# EAGLE schematic ledCubeV2.0 (EAGLE 9.6.2)
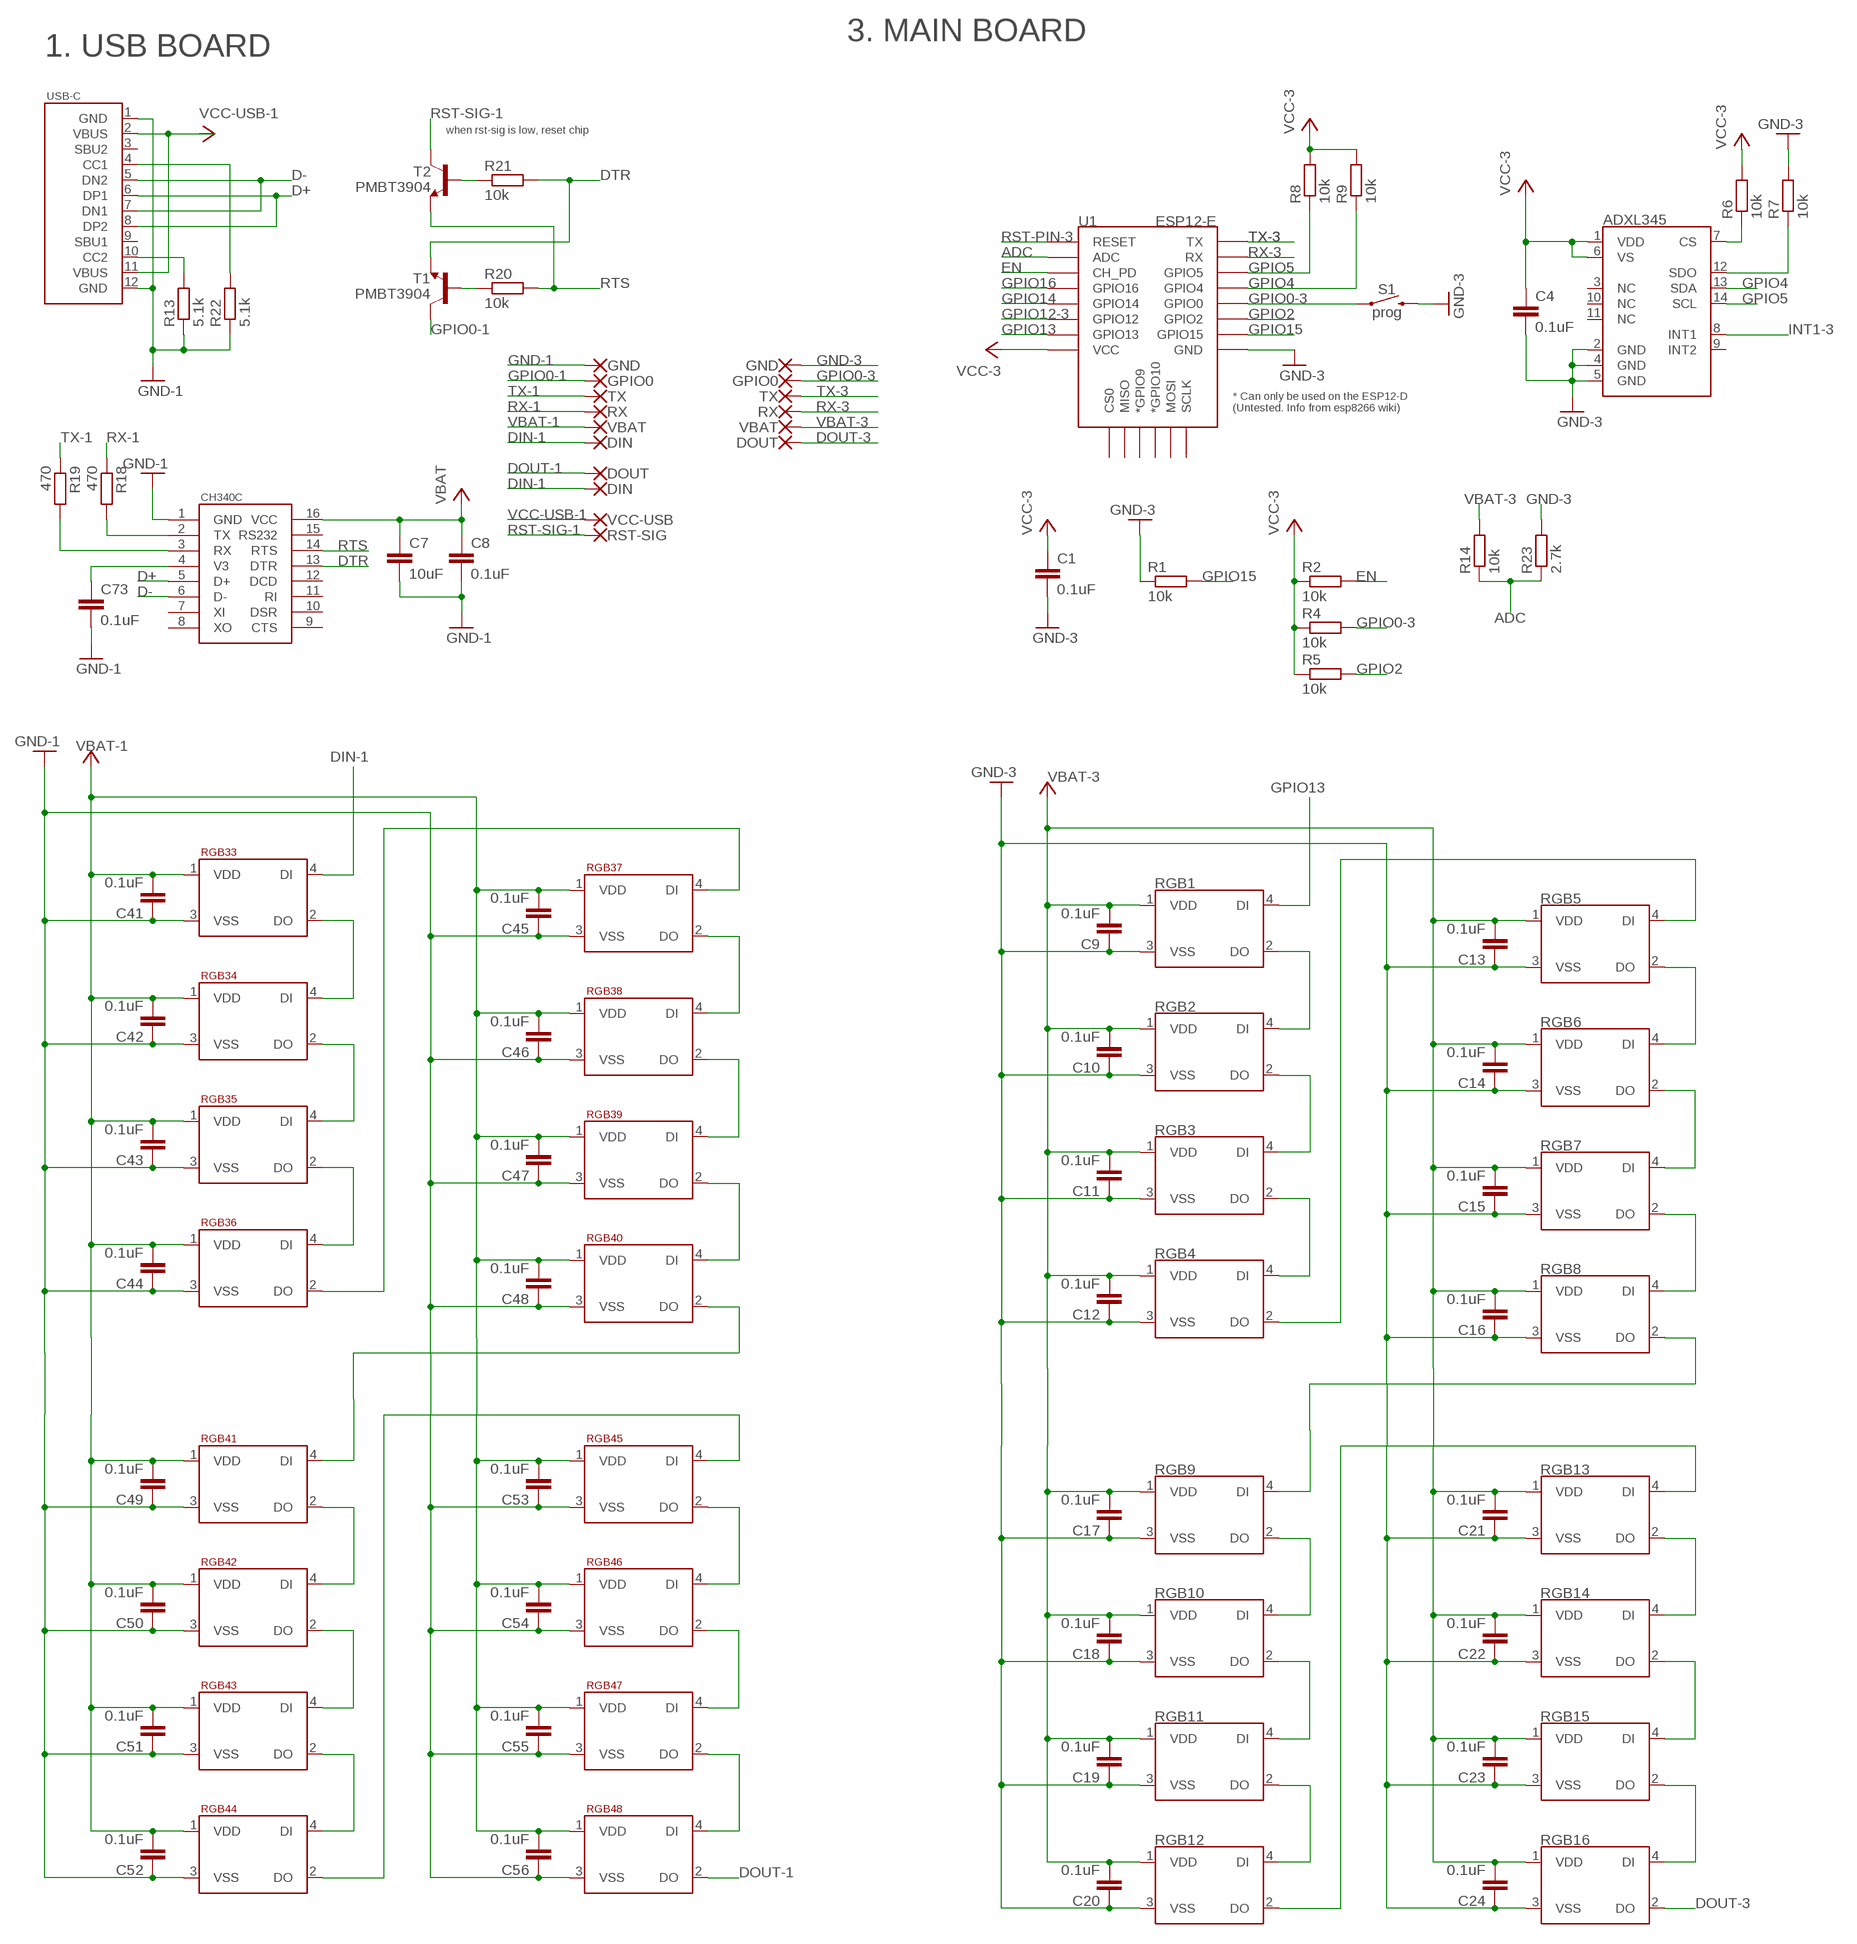
[diagram p0: schematic, sheet 1, part 1 of 2]
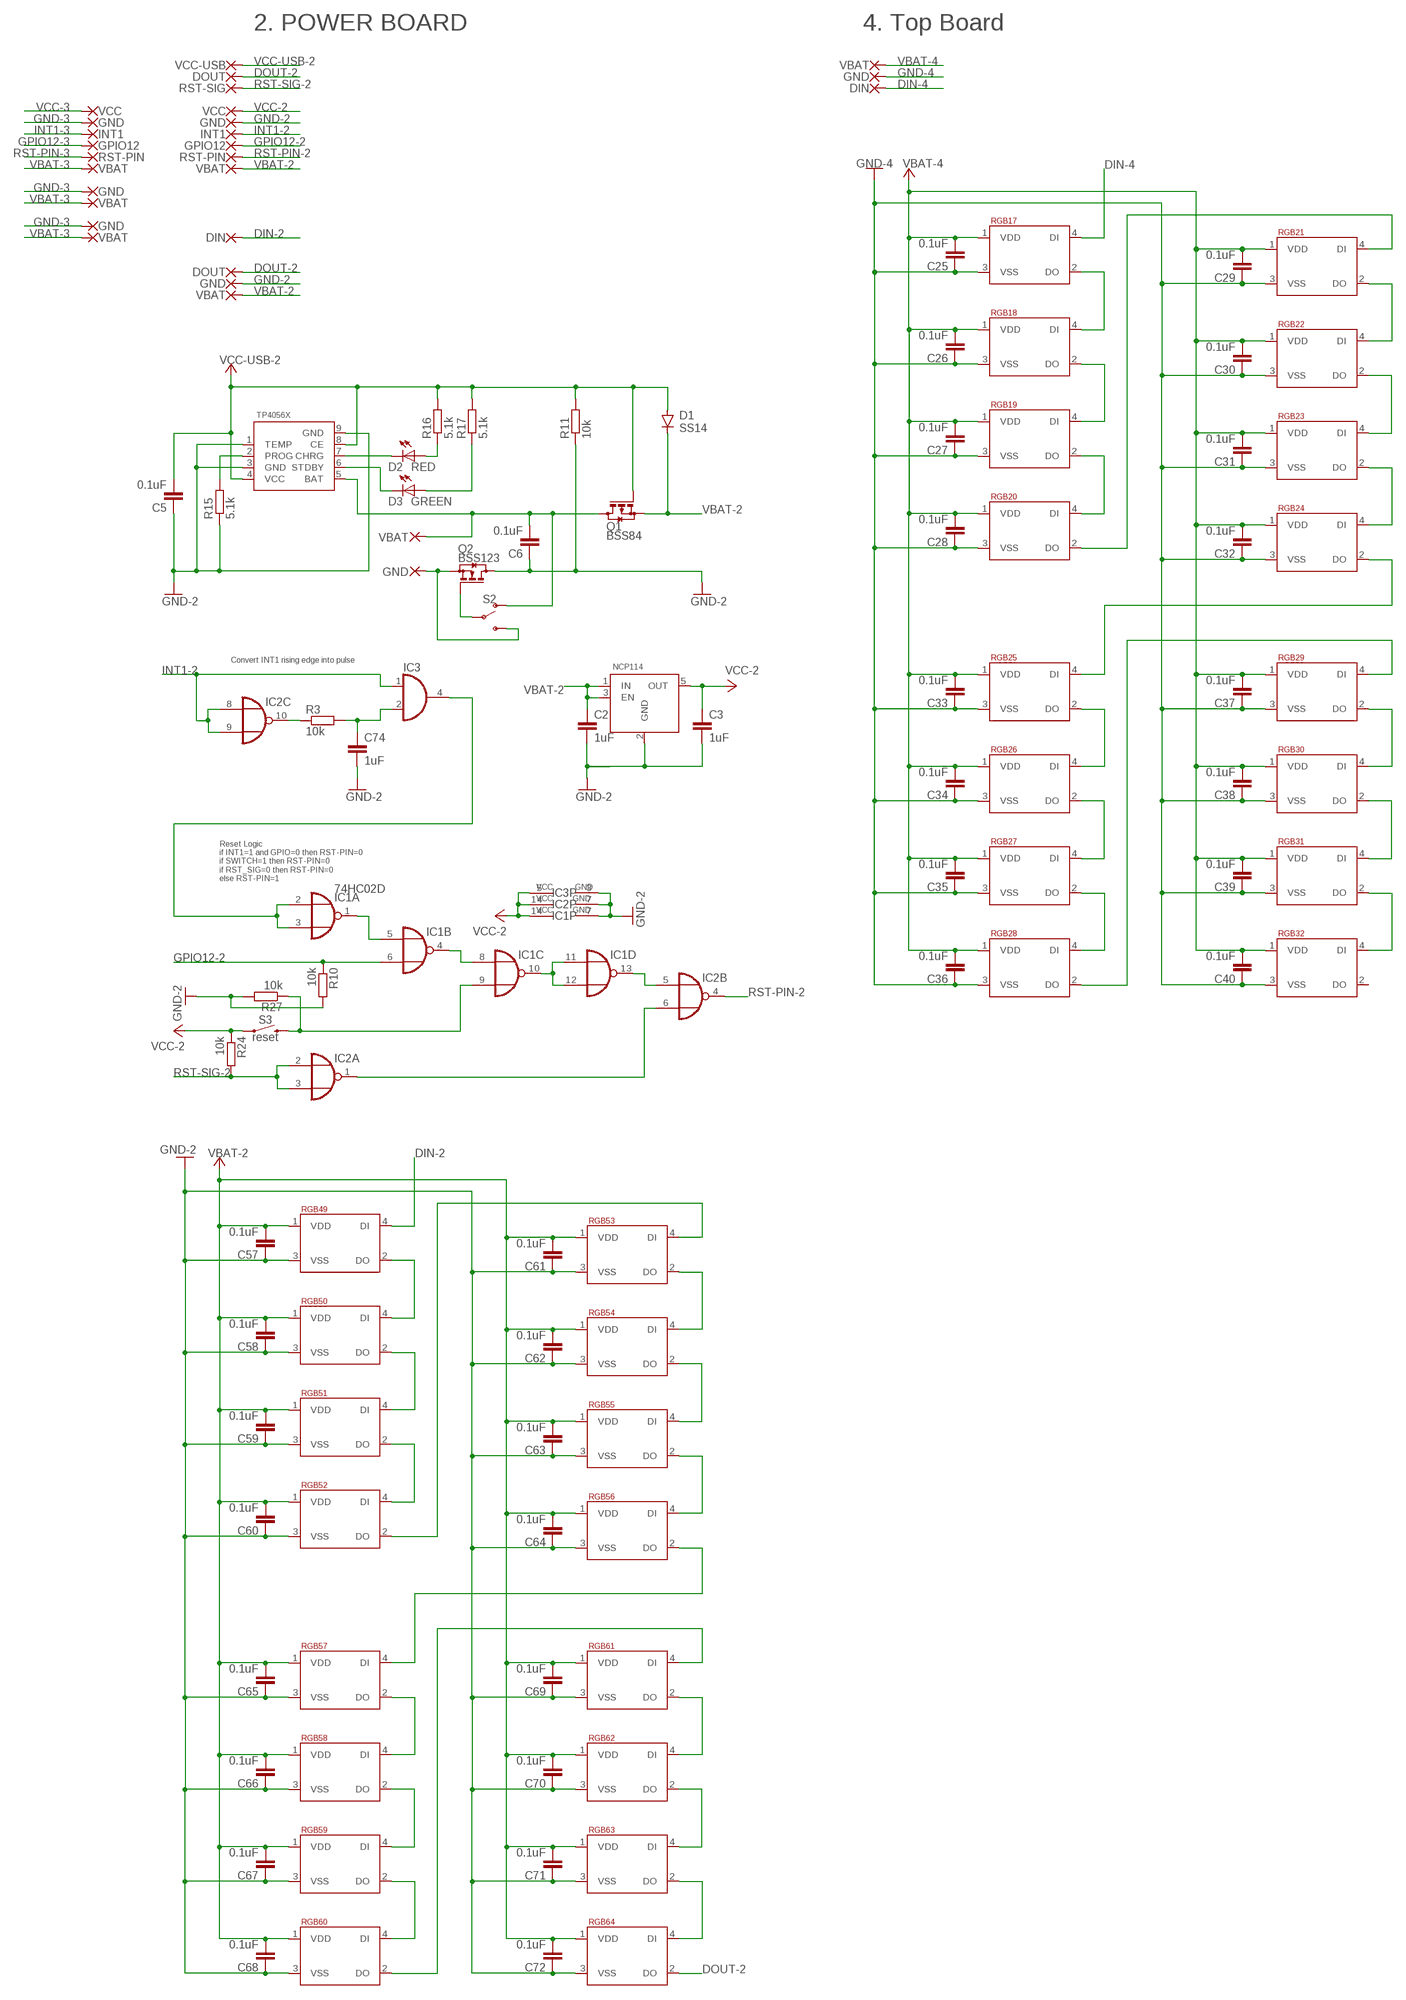
[diagram p1: schematic, sheet 1, part 2 of 2]

## Parts
ADXL345  ADXL345  [LGA-14]
C1  0.1uF  CC0603  [C0603]
C2  1uF  CC0603  [C0603]
C3  1uF  CC0603  [C0603]
C4  0.1uF  CC0603  [C0603]
C5  0.1uF  CC0603  [C0603]
C6  0.1uF  CC0603  [C0603]
C7  10uF  CC0603  [C0603]
C8  0.1uF  CC0603  [C0603]
C9  0.1uF  CC0603  [C0603]
C10  0.1uF  CC0603  [C0603]
C11  0.1uF  CC0603  [C0603]
C12  0.1uF  CC0603  [C0603]
C13  0.1uF  CC0603  [C0603]
C14  0.1uF  CC0603  [C0603]
C15  0.1uF  CC0603  [C0603]
C16  0.1uF  CC0603  [C0603]
C17  0.1uF  CC0603  [C0603]
C18  0.1uF  CC0603  [C0603]
C19  0.1uF  CC0603  [C0603]
C20  0.1uF  CC0603  [C0603]
C21  0.1uF  CC0603  [C0603]
C22  0.1uF  CC0603  [C0603]
C23  0.1uF  CC0603  [C0603]
C24  0.1uF  CC0603  [C0603]
C25  0.1uF  CC0603  [C0603]
C26  0.1uF  CC0603  [C0603]
C27  0.1uF  CC0603  [C0603]
C28  0.1uF  CC0603  [C0603]
C29  0.1uF  CC0603  [C0603]
C30  0.1uF  CC0603  [C0603]
C31  0.1uF  CC0603  [C0603]
C32  0.1uF  CC0603  [C0603]
C33  0.1uF  CC0603  [C0603]
C34  0.1uF  CC0603  [C0603]
C35  0.1uF  CC0603  [C0603]
C36  0.1uF  CC0603  [C0603]
C37  0.1uF  CC0603  [C0603]
C38  0.1uF  CC0603  [C0603]
C39  0.1uF  CC0603  [C0603]
C40  0.1uF  CC0603  [C0603]
C41  0.1uF  CC0603  [C0603]
C42  0.1uF  CC0603  [C0603]
C43  0.1uF  CC0603  [C0603]
C44  0.1uF  CC0603  [C0603]
C45  0.1uF  CC0603  [C0603]
C46  0.1uF  CC0603  [C0603]
C47  0.1uF  CC0603  [C0603]
C48  0.1uF  CC0603  [C0603]
C49  0.1uF  CC0603  [C0603]
C50  0.1uF  CC0603  [C0603]
C51  0.1uF  CC0603  [C0603]
C52  0.1uF  CC0603  [C0603]
C53  0.1uF  CC0603  [C0603]
C54  0.1uF  CC0603  [C0603]
C55  0.1uF  CC0603  [C0603]
C56  0.1uF  CC0603  [C0603]
C57  0.1uF  CC0603  [C0603]
C58  0.1uF  CC0603  [C0603]
C59  0.1uF  CC0603  [C0603]
C60  0.1uF  CC0603  [C0603]
C61  0.1uF  CC0603  [C0603]
C62  0.1uF  CC0603  [C0603]
C63  0.1uF  CC0603  [C0603]
C64  0.1uF  CC0603  [C0603]
C65  0.1uF  CC0603  [C0603]
C66  0.1uF  CC0603  [C0603]
C67  0.1uF  CC0603  [C0603]
C68  0.1uF  CC0603  [C0603]
C69  0.1uF  CC0603  [C0603]
C70  0.1uF  CC0603  [C0603]
C71  0.1uF  CC0603  [C0603]
C72  0.1uF  CC0603  [C0603]
C73  0.1uF  CC0603  [C0603]
C74  1uF  CC0603  [C0603]
CH340C  CH340G  [SOIC16]
D1  SS14  DIODE-DO-214AC  [DO-214AC]
D2  RED  LED_ESML0603  [LED_SML0603]
D3  GREEN  LED_ESML0603  [LED_SML0603]
GND  SMD2  [SMD1,27-2,54]
GND-1  GND  SMD2  [SMD1,27-2,54]
GND-2  RX  SMD2  [SMD1,27-2,54]
GPIO0-1  GPIO0  SMD2  [SMD1,27-2,54]
GPIO0-2  GPIO0  SMD2  [SMD1,27-2,54]
IC1  74HC02D  [SO14]
IC2  74HC02D  [SO14]
IC3  74AHC1G08DCK  [SC70-5]
NCP114  NCP114  [TSOP-5]
Q1  BSS84  [SOT23]
Q2  BSS123  [SOT23]
R1  10k  RR0603  [R0603]
R2  10k  RR0603  [R0603]
R3  10k  RR0603  [R0603]
R4  10k  RR0603  [R0603]
R5  10k  RR0603  [R0603]
R6  10k  RR0603  [R0603]
R7  10k  RR0603  [R0603]
R8  10k  RR0603  [R0603]
R9  10k  RR0603  [R0603]
R10  10k  RR0603  [R0603]
R11  10k  RR0603  [R0603]
R13  5.1k  RR0603  [R0603]
R14  10k  RR0603  [R0603]
R15  5.1k  RR0603  [R0603]
R16  5.1k  RR0603  [R0603]
R17  5.1k  RR0603  [R0603]
R18  470  RR0603  [R0603]
R19  470  RR0603  [R0603]
R20  10k  RR0603  [R0603]
R21  10k  RR0603  [R0603]
R22  5.1k  RR0603  [R0603]
R23  2.7k  RR0603  [R0603]
R24  10k  RR0603  [R0603]
R27  10k  RR0603  [R0603]
RGB1  WS2812B  WS2812B-MINI  [WS2812B-MINI]
RGB2  WS2812B  WS2812B-MINI  [WS2812B-MINI]
RGB3  WS2812B  WS2812B-MINI  [WS2812B-MINI]
RGB4  WS2812B  WS2812B-MINI  [WS2812B-MINI]
RGB5  WS2812B  WS2812B-MINI  [WS2812B-MINI]
RGB6  WS2812B  WS2812B-MINI  [WS2812B-MINI]
RGB7  WS2812B  WS2812B-MINI  [WS2812B-MINI]
RGB8  WS2812B  WS2812B-MINI  [WS2812B-MINI]
RGB9  WS2812B  WS2812B-MINI  [WS2812B-MINI]
RGB10  WS2812B  WS2812B-MINI  [WS2812B-MINI]
RGB11  WS2812B  WS2812B-MINI  [WS2812B-MINI]
RGB12  WS2812B  WS2812B-MINI  [WS2812B-MINI]
RGB13  WS2812B  WS2812B-MINI  [WS2812B-MINI]
RGB14  WS2812B  WS2812B-MINI  [WS2812B-MINI]
RGB15  WS2812B  WS2812B-MINI  [WS2812B-MINI]
RGB16  WS2812B  WS2812B-MINI  [WS2812B-MINI]
RGB17  WS2812B  WS2812B-MINI  [WS2812B-MINI]
RGB18  WS2812B  WS2812B-MINI  [WS2812B-MINI]
RGB19  WS2812B  WS2812B-MINI  [WS2812B-MINI]
RGB20  WS2812B  WS2812B-MINI  [WS2812B-MINI]
RGB21  WS2812B  WS2812B-MINI  [WS2812B-MINI]
RGB22  WS2812B  WS2812B-MINI  [WS2812B-MINI]
RGB23  WS2812B  WS2812B-MINI  [WS2812B-MINI]
RGB24  WS2812B  WS2812B-MINI  [WS2812B-MINI]
RGB25  WS2812B  WS2812B-MINI  [WS2812B-MINI]
RGB26  WS2812B  WS2812B-MINI  [WS2812B-MINI]
RGB27  WS2812B  WS2812B-MINI  [WS2812B-MINI]
RGB28  WS2812B  WS2812B-MINI  [WS2812B-MINI]
RGB29  WS2812B  WS2812B-MINI  [WS2812B-MINI]
RGB30  WS2812B  WS2812B-MINI  [WS2812B-MINI]
RGB31  WS2812B  WS2812B-MINI  [WS2812B-MINI]
RGB32  WS2812B  WS2812B-MINI  [WS2812B-MINI]
RGB33  WS2812B  WS2812B-MINI  [WS2812B-MINI]
RGB34  WS2812B  WS2812B-MINI  [WS2812B-MINI]
RGB35  WS2812B  WS2812B-MINI  [WS2812B-MINI]
RGB36  WS2812B  WS2812B-MINI  [WS2812B-MINI]
RGB37  WS2812B  WS2812B-MINI  [WS2812B-MINI]
RGB38  WS2812B  WS2812B-MINI  [WS2812B-MINI]
RGB39  WS2812B  WS2812B-MINI  [WS2812B-MINI]
RGB40  WS2812B  WS2812B-MINI  [WS2812B-MINI]
RGB41  WS2812B  WS2812B-MINI  [WS2812B-MINI]
RGB42  WS2812B  WS2812B-MINI  [WS2812B-MINI]
RGB43  WS2812B  WS2812B-MINI  [WS2812B-MINI]
RGB44  WS2812B  WS2812B-MINI  [WS2812B-MINI]
RGB45  WS2812B  WS2812B-MINI  [WS2812B-MINI]
RGB46  WS2812B  WS2812B-MINI  [WS2812B-MINI]
RGB47  WS2812B  WS2812B-MINI  [WS2812B-MINI]
RGB48  WS2812B  WS2812B-MINI  [WS2812B-MINI]
RGB49  WS2812B  WS2812B-MINI  [WS2812B-MINI]
RGB50  WS2812B  WS2812B-MINI  [WS2812B-MINI]
RGB51  WS2812B  WS2812B-MINI  [WS2812B-MINI]
RGB52  WS2812B  WS2812B-MINI  [WS2812B-MINI]
RGB53  WS2812B  WS2812B-MINI  [WS2812B-MINI]
RGB54  WS2812B  WS2812B-MINI  [WS2812B-MINI]
RGB55  WS2812B  WS2812B-MINI  [WS2812B-MINI]
RGB56  WS2812B  WS2812B-MINI  [WS2812B-MINI]
RGB57  WS2812B  WS2812B-MINI  [WS2812B-MINI]
RGB58  WS2812B  WS2812B-MINI  [WS2812B-MINI]
RGB59  WS2812B  WS2812B-MINI  [WS2812B-MINI]
RGB60  WS2812B  WS2812B-MINI  [WS2812B-MINI]
RGB61  WS2812B  WS2812B-MINI  [WS2812B-MINI]
RGB62  WS2812B  WS2812B-MINI  [WS2812B-MINI]
RGB63  WS2812B  WS2812B-MINI  [WS2812B-MINI]
RGB64  WS2812B  WS2812B-MINI  [WS2812B-MINI]
RST-SIG-1  RST-SIG  SMD2  [SMD1,27-2,54]
RST-SIG-2  TX  SMD2  [SMD1,27-2,54]
RX-1  RX  SMD2  [SMD1,27-2,54]
RX-2  GND  SMD2  [SMD1,27-2,54]
RX-3  GND  SMD2  [SMD1,27-2,54]
S1  prog  MOMENTARY-SWITCH-SPST-SMD-6.0X3.5MM  [TACTILE_SWITCH_SMD_6.0X3.5MM]
S2  ON/CHRG  SWITCH-SPDT-SMD-RIGHT-ANGLE  [SWITCH_SPST_SMD_A]
S3  reset  MOMENTARY-SWITCH-SPST-SMD-6.0X3.5MM  [TACTILE_SWITCH_SMD_6.0X3.5MM]
T1  PMBT3904  MMBT3904LT1-NPN-SOT23-BEC  [SOT23-BEC]
T2  PMBT3904  MMBT3904LT1-NPN-SOT23-BEC  [SOT23-BEC]
TP4056X  TP4056X  [ESPO8]
TX-1  TX  SMD2  [SMD1,27-2,54]
TX-3  DIN  SMD2  [SMD1,27-2,54]
U1  ESP12-E  ESP12ESMD  [ESP12E-SMD]
USB-C  USB-C  [USB-C]
VBAT  SMD2  [SMD1,27-2,54]
VCC1  VBAT  SMD2  [SMD1,27-2,54]
VCC2  VBAT  SMD2  [SMD1,27-2,54]
VCC3  VBAT  SMD2  [SMD1,27-2,54]
VCC4  VBAT  SMD2  [SMD1,27-2,54]
VCC5  VBAT  SMD2  [SMD1,27-2,54]
VCC6  VBAT  SMD2  [SMD1,27-2,54]
VCC-USB-1  VBAT  SMD2  [SMD1,27-2,54]
VCC-USB-3  VBAT  SMD2  [SMD1,27-2,54]
VCC-USB-4  DIN  SMD2  [SMD1,27-2,54]
VCC-USB-5  DOUT  SMD2  [SMD1,27-2,54]
VCC-USB-6  DOUT  SMD2  [SMD1,27-2,54]
VCC-USB-7  DIN  SMD2  [SMD1,27-2,54]
VCC-USB-8  DOUT  SMD2  [SMD1,27-2,54]
VCC-USB-9  DIN  SMD2  [SMD1,27-2,54]
VCC-USB-10  GND  SMD2  [SMD1,27-2,54]
VCC-USB-11  VCC  SMD2  [SMD1,27-2,54]
VCC-USB-12  INT1  SMD2  [SMD1,27-2,54]
VCC-USB-13  GND  SMD2  [SMD1,27-2,54]
VCC-USB-14  VCC-USB  SMD2  [SMD1,27-2,54]
VCC-USB-15  DOUT  SMD2  [SMD1,27-2,54]
VCC-USB-16  RST-SIG  SMD2  [SMD1,27-2,54]
VCC-USB-17  GPIO12  SMD2  [SMD1,27-2,54]
VCC-USB-18  RST-PIN  SMD2  [SMD1,27-2,54]
VCC-USB-19  GND  SMD2  [SMD1,27-2,54]
VCC-USB-20  VCC-USB  SMD2  [SMD1,27-2,54]
VCC-USB-21  VCC  SMD2  [SMD1,27-2,54]
VCC-USB-22  INT1  SMD2  [SMD1,27-2,54]
VCC-USB-23  GPIO12  SMD2  [SMD1,27-2,54]
VCC-USB-24  RST-PIN  SMD2  [SMD1,27-2,54]
VCC-USB-25  GND  SMD2  [SMD1,27-2,54]
VCC-USB-26  GND  SMD2  [SMD1,27-2,54]

## Nets
ADC: R14.1 R23.1 U1.ADC
D+: CH340C.5(D+) USB-C.6(DP1) USB-C.8(DP2)
D-: CH340C.6(D-) USB-C.5(DN2) USB-C.7(DN1)
DIN-1: RGB33.4(DI) VCC-USB-4.1(P) VCC-USB-7.1(P)
DIN-2: RGB49.4(DI) VCC-USB-9.1(P)
DIN-4: RGB17.4(DI) TX-3.1(P)
DOUT-1: RGB48.2(DO) VCC-USB-6.1(P)
DOUT-2: RGB64.2(DO) VCC-USB-8.1(P) VCC-USB-15.1(P)
DOUT-3: RGB16.2(DO) VCC-USB-5.1(P)
DTR: CH340C.13(DTR) R21.2 T1.E
EN: R2.2 U1.CH_PD
GND-1: C7.2 C8.2 C41.1 C42.1 C43.1 C44.1 C45.1 C46.1 C47.1 C48.1 C49.1 C50.1 C51.1 C52.1 C53.1 C54.1 C55.1 C56.1 C73.2 CH340C.1(GND) GND-1.1(P) R13.1 R22.1 RGB33.3(VSS) RGB34.3(VSS) RGB35.3(VSS) RGB36.3(VSS) RGB37.3(VSS) RGB38.3(VSS) RGB39.3(VSS) RGB40.3(VSS) RGB41.3(VSS) RGB42.3(VSS) RGB43.3(VSS) RGB44.3(VSS) RGB45.3(VSS) RGB46.3(VSS) RGB47.3(VSS) RGB48.3(VSS) USB-C.1(GND) USB-C.12(GND)
GND-2: C2.2 C3.2 C5.1 C6.1 C57.1 C58.1 C59.1 C60.1 C61.1 C62.1 C63.1 C64.1 C65.1 C66.1 C67.1 C68.1 C69.1 C70.1 C71.1 C72.1 C74.2 IC1.7(P:GND) IC2.7(P:GND) IC3.3(GND) NCP114.2(GND) Q2.3(D) R10.2 R11.1 R15.1 R27.2 RGB49.3(VSS) RGB50.3(VSS) RGB51.3(VSS) RGB52.3(VSS) RGB53.3(VSS) RGB54.3(VSS) RGB55.3(VSS) RGB56.3(VSS) RGB57.3(VSS) RGB58.3(VSS) RGB59.3(VSS) RGB60.3(VSS) RGB61.3(VSS) RGB62.3(VSS) RGB63.3(VSS) RGB64.3(VSS) TP4056X.1(TEMP) TP4056X.3(GND) TP4056X.9(GND) VCC-USB-10.1(P) VCC-USB-19.1(P)
GND-3: ADXL345.2(GND) ADXL345.4(GND) ADXL345.5(GND) C1.2 C4.2 C9.1 C10.1 C11.1 C12.1 C13.1 C14.1 C15.1 C16.1 C17.1 C18.1 C19.1 C20.1 C21.1 C22.1 C23.1 C24.1 R1.1 R7.2 R23.2 RGB1.3(VSS) RGB2.3(VSS) RGB3.3(VSS) RGB4.3(VSS) RGB5.3(VSS) RGB6.3(VSS) RGB7.3(VSS) RGB8.3(VSS) RGB9.3(VSS) RGB10.3(VSS) RGB11.3(VSS) RGB12.3(VSS) RGB13.3(VSS) RGB14.3(VSS) RGB15.3(VSS) RGB16.3(VSS) RX-2.1(P) S1.2 U1.GND VCC-USB-13.1(P) VCC-USB-25.1(P) VCC-USB-26.1(P)
GND-4: C25.1 C26.1 C27.1 C28.1 C29.1 C30.1 C31.1 C32.1 C33.1 C34.1 C35.1 C36.1 C37.1 C38.1 C39.1 C40.1 RGB17.3(VSS) RGB18.3(VSS) RGB19.3(VSS) RGB20.3(VSS) RGB21.3(VSS) RGB22.3(VSS) RGB23.3(VSS) RGB24.3(VSS) RGB25.3(VSS) RGB26.3(VSS) RGB27.3(VSS) RGB28.3(VSS) RGB29.3(VSS) RGB30.3(VSS) RGB31.3(VSS) RGB32.3(VSS) RX-3.1(P)
GPIO0-1: GPIO0-1.1(P) T1.C
GPIO0-3: GPIO0-2.1(P) R4.2 S1.1 U1.GPIO0
GPIO2: R5.2 U1.GPIO2
GPIO4: ADXL345.13(SDA) R9.1 U1.GPIO4
GPIO5: ADXL345.14(SCL) R8.1 U1.GPIO5
GPIO12-2: IC1.6(B:I1) R10.1 VCC-USB-17.1(P)
GPIO12-3: U1.GPIO12 VCC-USB-23.1(P)
GPIO13: RGB1.4(DI) U1.GPIO13
GPIO14: U1.GPIO14
GPIO15: R1.2 U1.GPIO15
GPIO16: U1.GPIO16
INT1-2: IC2.8(C:I0) IC2.9(C:I1) IC3.1(I0) VCC-USB-12.1(P)
INT1-3: ADXL345.8(INT1) VCC-USB-22.1(P)
N$1: RGB1.2(DO) RGB2.4(DI)
N$2: CH340C.2(TX) R18.2
N$3: ADXL345.7(CS) R6.1
N$4: ADXL345.12(SDO) R7.1
N$5: R13.2 USB-C.10(CC2)
N$6: IC1.2(A:I0) IC1.3(A:I1) IC3.4(O)
N$7: R22.2 USB-C.4(CC1)
N$8: GND.1(P) Q2.2(S) S2.3(S)
N$9: D2.C TP4056X.7(CHRG)
N$10: D3.C TP4056X.6(STDBY)
N$11: R15.2 TP4056X.2(PROG)
N$12: D2.A R16.1
N$13: D3.A R17.1
N$14: CH340C.3(RX) R19.2
N$15: C6.2 Q1.3(D) S2.1(O) TP4056X.5(BAT) VBAT.1(P)
N$16: R20.1 T1.B
N$17: RGB4.2(DO) RGB5.4(DI)
N$18: RGB2.2(DO) RGB3.4(DI)
N$19: R21.1 T2.B
N$20: RGB3.2(DO) RGB4.4(DI)
N$21: RGB5.2(DO) RGB6.4(DI)
N$22: RGB6.2(DO) RGB7.4(DI)
N$23: RGB7.2(DO) RGB8.4(DI)
N$24: RGB8.2(DO) RGB9.4(DI)
N$25: RGB9.2(DO) RGB10.4(DI)
N$26: RGB10.2(DO) RGB11.4(DI)
N$27: RGB11.2(DO) RGB12.4(DI)
N$28: RGB12.2(DO) RGB13.4(DI)
N$29: RGB13.2(DO) RGB14.4(DI)
N$30: RGB14.2(DO) RGB15.4(DI)
N$31: RGB15.2(DO) RGB16.4(DI)
N$32: RGB20.2(DO) RGB21.4(DI)
N$33: RGB17.2(DO) RGB18.4(DI)
N$34: RGB18.2(DO) RGB19.4(DI)
N$35: RGB19.2(DO) RGB20.4(DI)
N$36: RGB21.2(DO) RGB22.4(DI)
N$37: RGB22.2(DO) RGB23.4(DI)
N$38: RGB23.2(DO) RGB24.4(DI)
N$39: RGB24.2(DO) RGB25.4(DI)
N$40: RGB25.2(DO) RGB26.4(DI)
N$41: RGB26.2(DO) RGB27.4(DI)
N$42: RGB27.2(DO) RGB28.4(DI)
N$43: RGB28.2(DO) RGB29.4(DI)
N$44: RGB29.2(DO) RGB30.4(DI)
N$45: RGB30.2(DO) RGB31.4(DI)
N$46: RGB31.2(DO) RGB32.4(DI)
N$47: RGB36.2(DO) RGB37.4(DI)
N$48: RGB33.2(DO) RGB34.4(DI)
N$49: RGB34.2(DO) RGB35.4(DI)
N$50: RGB35.2(DO) RGB36.4(DI)
N$51: RGB37.2(DO) RGB38.4(DI)
N$52: RGB38.2(DO) RGB39.4(DI)
N$53: RGB39.2(DO) RGB40.4(DI)
N$54: RGB40.2(DO) RGB41.4(DI)
N$55: RGB41.2(DO) RGB42.4(DI)
N$56: RGB42.2(DO) RGB43.4(DI)
N$57: RGB43.2(DO) RGB44.4(DI)
N$58: RGB44.2(DO) RGB45.4(DI)
N$59: RGB45.2(DO) RGB46.4(DI)
N$60: RGB46.2(DO) RGB47.4(DI)
N$61: RGB47.2(DO) RGB48.4(DI)
N$62: RGB52.2(DO) RGB53.4(DI)
N$63: RGB49.2(DO) RGB50.4(DI)
N$64: RGB50.2(DO) RGB51.4(DI)
N$65: RGB51.2(DO) RGB52.4(DI)
N$66: RGB53.2(DO) RGB54.4(DI)
N$67: RGB54.2(DO) RGB55.4(DI)
N$68: RGB55.2(DO) RGB56.4(DI)
N$69: RGB56.2(DO) RGB57.4(DI)
N$70: RGB57.2(DO) RGB58.4(DI)
N$71: RGB58.2(DO) RGB59.4(DI)
N$72: RGB59.2(DO) RGB60.4(DI)
N$73: RGB60.2(DO) RGB61.4(DI)
N$74: RGB61.2(DO) RGB62.4(DI)
N$75: RGB62.2(DO) RGB63.4(DI)
N$76: RGB63.2(DO) RGB64.4(DI)
N$77: C73.1 CH340C.4(V3)
N$78: C74.1 IC3.2(I1) R3.2
N$79: IC1.9(C:I1) R27.1 S3.2
N$80: IC1.1(A:O) IC1.5(B:I0)
N$81: IC1.10(C:O) IC1.11(D:I0) IC1.12(D:I1)
N$82: IC1.4(B:O) IC1.8(C:I0)
N$83: IC2.1(A:O) IC2.6(B:I1)
N$84: IC1.13(D:O) IC2.5(B:I0)
N$85: IC2.10(C:O) R3.1
N$86: Q2.1(G) S2.2(P)
RST-PIN-2: IC2.4(B:O) VCC-USB-18.1(P)
RST-PIN-3: U1.RESET VCC-USB-24.1(P)
RST-SIG-1: RST-SIG-1.1(P) T2.C
RST-SIG-2: IC2.2(A:I0) IC2.3(A:I1) R24.2 VCC-USB-16.1(P)
RTS: CH340C.14(RTS) R20.2 T2.E
RX-1: R18.1 RX-1.1(P)
RX-3: GND-2.1(P) U1.RXD0(RX)
TX-1: R19.1 TX-1.1(P)
TX-3: RST-SIG-2.1(P) U1.TXD0(TX)
VBAT: C7.1 C8.1 CH340C.16(VCC)
VBAT-1: C41.2 C42.2 C43.2 C44.2 C45.2 C46.2 C47.2 C48.2 C49.2 C50.2 C51.2 C52.2 C53.2 C54.2 C55.2 C56.2 RGB33.1(VDD) RGB34.1(VDD) RGB35.1(VDD) RGB36.1(VDD) RGB37.1(VDD) RGB38.1(VDD) RGB39.1(VDD) RGB40.1(VDD) RGB41.1(VDD) RGB42.1(VDD) RGB43.1(VDD) RGB44.1(VDD) RGB45.1(VDD) RGB46.1(VDD) RGB47.1(VDD) RGB48.1(VDD) VCC-USB-1.1(P)
VBAT-2: C2.1 C57.2 C58.2 C59.2 C60.2 C61.2 C62.2 C63.2 C64.2 C65.2 C66.2 C67.2 C68.2 C69.2 C70.2 C71.2 C72.2 D1.C NCP114.1(IN) NCP114.3(EN) Q1.2(S) RGB49.1(VDD) RGB50.1(VDD) RGB51.1(VDD) RGB52.1(VDD) RGB53.1(VDD) RGB54.1(VDD) RGB55.1(VDD) RGB56.1(VDD) RGB57.1(VDD) RGB58.1(VDD) RGB59.1(VDD) RGB60.1(VDD) RGB61.1(VDD) RGB62.1(VDD) RGB63.1(VDD) RGB64.1(VDD) VCC2.1(P) VCC3.1(P)
VBAT-3: C9.2 C10.2 C11.2 C12.2 C13.2 C14.2 C15.2 C16.2 C17.2 C18.2 C19.2 C20.2 C21.2 C22.2 C23.2 C24.2 R14.2 RGB1.1(VDD) RGB2.1(VDD) RGB3.1(VDD) RGB4.1(VDD) RGB5.1(VDD) RGB6.1(VDD) RGB7.1(VDD) RGB8.1(VDD) RGB9.1(VDD) RGB10.1(VDD) RGB11.1(VDD) RGB12.1(VDD) RGB13.1(VDD) RGB14.1(VDD) RGB15.1(VDD) RGB16.1(VDD) VCC1.1(P) VCC4.1(P) VCC5.1(P) VCC6.1(P)
VBAT-4: C25.2 C26.2 C27.2 C28.2 C29.2 C30.2 C31.2 C32.2 C33.2 C34.2 C35.2 C36.2 C37.2 C38.2 C39.2 C40.2 RGB17.1(VDD) RGB18.1(VDD) RGB19.1(VDD) RGB20.1(VDD) RGB21.1(VDD) RGB22.1(VDD) RGB23.1(VDD) RGB24.1(VDD) RGB25.1(VDD) RGB26.1(VDD) RGB27.1(VDD) RGB28.1(VDD) RGB29.1(VDD) RGB30.1(VDD) RGB31.1(VDD) RGB32.1(VDD) VCC-USB-3.1(P)
VCC-2: C3.1 IC1.14(P:VCC) IC2.14(P:VCC) IC3.5(VCC) NCP114.5(OUT) R24.1 S3.1 VCC-USB-11.1(P)
VCC-3: ADXL345.1(VDD) ADXL345.6(VS) C1.1 C4.1 R2.1 R4.1 R5.1 R6.2 R8.2 R9.2 U1.VCC VCC-USB-21.1(P)
VCC-USB-1: USB-C.2(VBUS) USB-C.11(VBUS) VCC-USB-14.1(P)
VCC-USB-2: C5.2 D1.A Q1.1(G) R11.2 R16.2 R17.2 TP4056X.4(VCC) TP4056X.8(CE) VCC-USB-20.1(P)
Unconnected: ADXL345.3(NC) ADXL345.9(INT2) ADXL345.10(NC) ADXL345.11(NC) CH340C.7(XI) CH340C.8(XO) CH340C.9(CTS) CH340C.10(DSR) CH340C.11(RI) CH340C.12(DCD) CH340C.15(RS232) IC2.11(D:I0) IC2.12(D:I1) IC2.13(D:O) RGB32.2(DO) U1.CS0 U1.GPIO9(*GPIO9) U1.GPIO10(*GPIO10) U1.MISO U1.MOSI U1.SCLK USB-C.3(SBU2) USB-C.9(SBU1)

## Notes on the sheet
- 3. MAIN BOARD
- 1. USB BOARD
- 2. POWER BOARD | 4. Top Board
- when rst-sig is low, reset chip
- Convert INT1 rising edge into pulse
- Reset Logic
  if INT1=1 and GPIO=0 then RST-PIN=0
  if SWITCH=1 then RST-PIN=0
  if RST_SIG=0 then RST-PIN=0
  else RST-PIN=1

## Library data of the parts
ADXL345 = personal:ADXL345: Analog Devices ADXL345 3-Axis SPI/I2C 2/4/8/16g Accelerometer The ADXL345 is a small, thin, low power, 3-axis accelerometer with high resolution (13-bit) measurement at up to ±16g. Digital output data is formatted as 16-bit twos complement and is accessible through either a SPI (3- or 4-wire) or I2C digital interface. Datasheet <https://www.sparkfun.com/datasheets/Sensors/Accelerometer/ADXL345.pdf> SparkFun Products SparkFun Triple Axis Accelerometer Breakout - ADXL345 <https://www.sparkfun.com/products/9836> (SEN-09836) Triple Axis Accelerometer - ADXL345 <https://www.sparkfun.com/products/9045> (SEN-09045) SparkFun 6 Degrees of Freedom IMU Digital Combo Board - ITG3200/ADXL345 <https://www.sparkfun.com/products/10121> (SEN-10121); PROD_ID: IC-09097; SF_ID: SEN-09045
C1-C74 = eagle-ltspice:C: CAPACITOR, European symbol; SPICEMODEL: NONE; SPICEPREFIX: C
CH340C = usb-serial:CH340G
D1 = diode:DIODE-: DIODE
D2 D3 = eagle-ltspice:LED_E: LED Source: http://www.osram.convergy.de Source: www.luxeon.com Source: www.kingbright.com; SPICEMODEL: NONE; SPICEPREFIX: D; SPICETYPE: diode
GND GND-1 GND-2 GPIO0-1 GPIO0-2 RST-SIG-1 RST-SIG-2 RX-1-RX-3 TX-1 TX-3 VBAT VCC1-VCC6 VCC-USB-1 VCC-USB-3-VCC-USB-26 = personal:SMD2: SMD PAD
IC1 IC2 = 74xx-eu:74*02: Quad 2-input NOR gate
IC3 = 74xx-little-de:74*1G08: 2-input AND gate
NCP114 = personal:NCP114
Q1 = transistor-small-signal:BSS84: P-CHANNEL MOS FET
Q2 = transistor-small-signal:BSS123: N-CHANNEL MOS FET
R1-R11 R13-R24 R27 = eagle-ltspice:R: RESISTOR, European symbol; SPICEMODEL: NONE; SPICEPREFIX: R
RGB1-RGB64 = personal:WS2812B-MINI
S1 S3 = SparkFun-Switches:MOMENTARY-SWITCH-SPST: Momentary Switch (Pushbutton) - SPST Normally-open (NO) SPST momentary switches (buttons, pushbuttons). Variants PTH-12MM - 12mm square, through-hole Momentary Pushbutton Switch - 12mm Square <https://www.sparkfun.com/products/9190> (COM-09190) PTH-6.0MM, PTH-6.0MM-KIT - 6.0mm square, through-hole Mini Pushbutton Switch <https://www.sparkfun.com/products/97> (COM-00097) KIT package intended for soldering kit's - only one side of pads' copper is exposed. PTH-RIGHT-ANGLE-KIT - Right-angle, through-hole Right Angle Tactile Button <https://www.sparkfun.com/products/10791> - Used on SparkFun BigTime Watch Kit <https://www.sparkfun.com/products/11734> SMD-12MM - 12mm square, surface-mount Tactile Button - SMD (12mm) <https://www.sparkfun.com/products/12993> (COM-12993) Used on SparkFun PicoBoard <https://www.sparkfun.com/products/11888> SMD-4.5MM - 4.5mm Square Trackball Switch Used on SparkFun Blackberry Trackballer Breakout <https://www.sparkfun.com/products/13169> SMD-4.6MMX2.8MM - 4.60mm x 2.80mm, surface mount Used on SparkFun SAMD21 Mini Breakout <https://www.sparkfun.com/products/13664> SMD-5.2MM, SMD-5.2-REDUNDANT - 5.2mm square, surface-mount Mini Pushbutton Switch - SMD <https://www.sparkfun.com/products/8720> (COM-08720) Used on Arduino Pro Mini <https://www.sparkfun.com/products/11114> REDUNDANT package connects both switch circuits together SMD-6.0X3.5MM - 6.0 x 3.5mm, surface mount Momentary Reset Switch SMD <https://www.sparkfun.com/products/8229> (COM-08229) SMD-6.2MM-TALL - 6.2mm square, surface mount Tactile Button - SMD (6mm) <https://www.sparkfun.com/products/12992> Used on SparkFun Digital Sandbox <https://www.sparkfun.com/products/12651> SMD-RIGHT-ANGLE - Right-angle, surface mount Used on SparkFun Block for Intel® Edison - Arduino <https://www.sparkfun.com/products/13036>; PROD_ID: SWCH-00815; SF_SKU: COM-08229
S2 = SparkFun-Switches:SWITCH-SPDT: Single Pole, Double Throw (SPDT) Switch Single-pole, double-throw (SPDT) switch. Variant Overview SMD-AYZ0202 Surface Mount DPDT Switch <https://www.sparkfun.com/products/597> (COM-00597) Used on e.g. LilyPad Arduino USB - ATmega32U4 Board <https://www.sparkfun.com/products/12049> PTH-11.6X4.0MM SPDT Mini Power Switch <https://www.sparkfun.com/products/102> (COM-00102) Used on e.g. SparkFun Simon Says - Through-Hole Soldering Kit <https://www.sparkfun.com/products/10547> (KIT-10547) PTH-11.6X4.0MM-KIT KIT version of SPDT Mini Power Switch - Simplifies soldering by removing tStop of switch pins - only one side can be soldered. PTH-11.6X4.0MM-LOCK LOCK version of SPDT Mini Power Switch - Offset pins hold switch in place for easier soldering. SMD-RIGHT-ANGLE Surface Mount Right Angle Switch <https://www.sparkfun.com/products/10860> (COM-10860) Used on e.g. SparkFun ESP8266 Thing <https://www.sparkfun.com/products/13231>; PROD_ID: SWCH-10651; SF_SKU: COM-10860
T1 T2 = transistor-neu-to92:*-NPN-: NPN Transistror
TP4056X = personal:TP4056X
U1 = esp8266modules:ESP12E: ESP12E Module
USB-C = personal:USB-C

## Net classes
0 default: clearance 0.127 mm